# Altium schematic sheet [1]H-bridge1&Current_sensor&NOT_gate.SchDoc
size A3
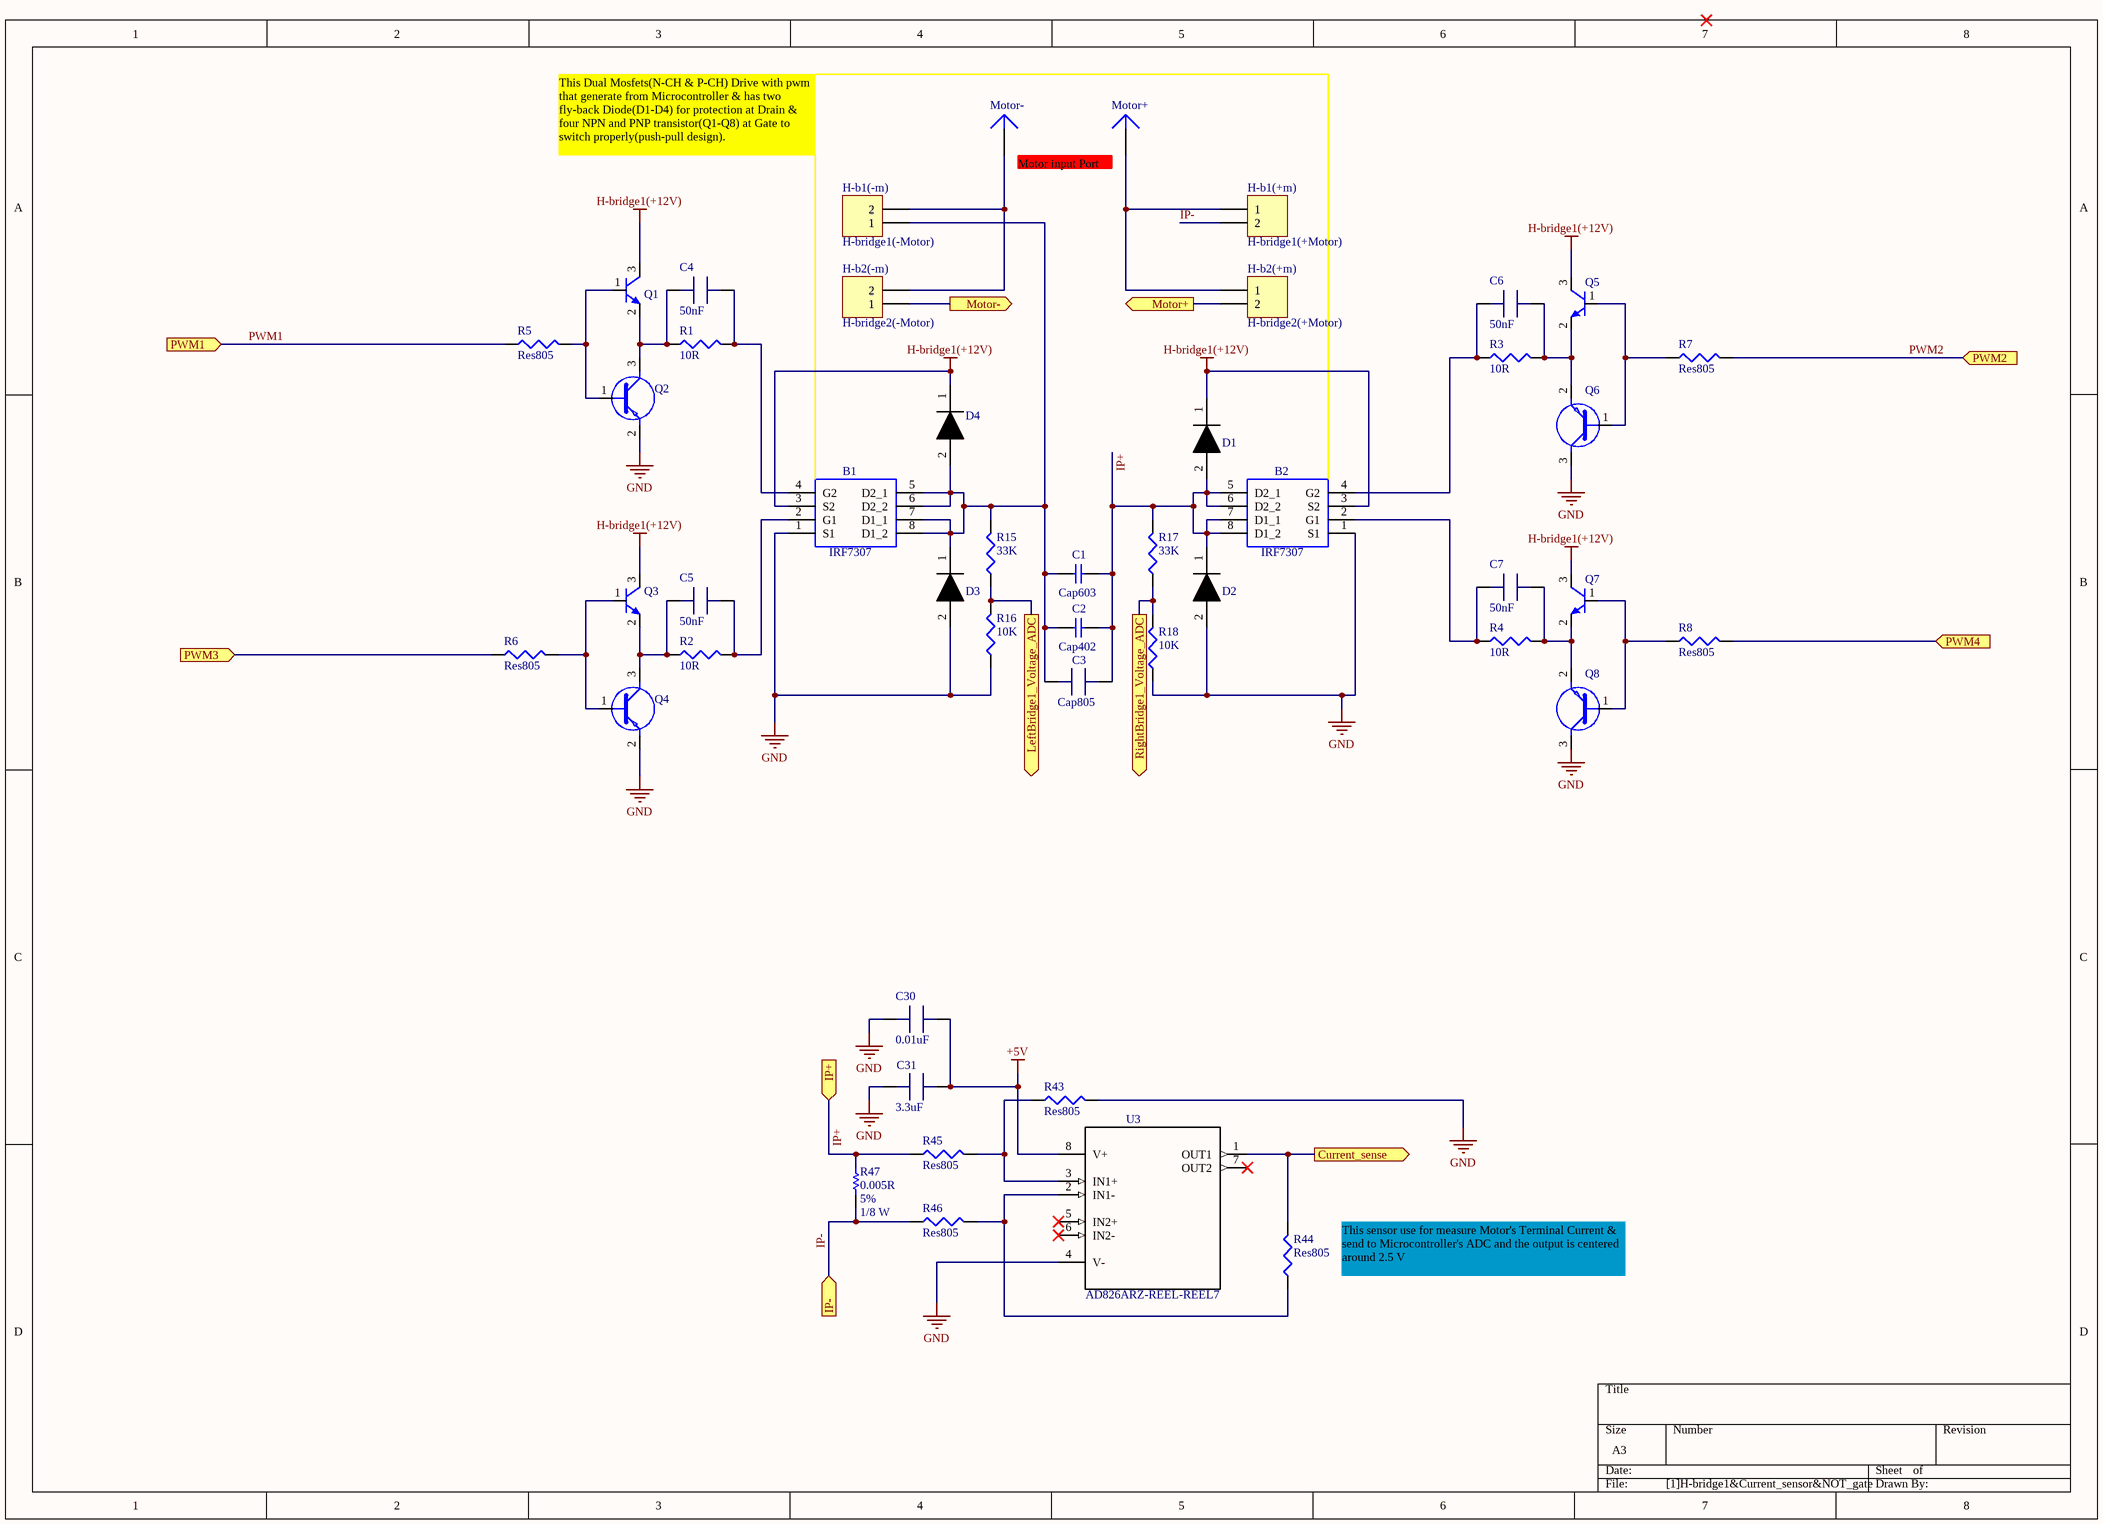
[diagram p0: [1]H-bridge1&Current_sensor&NOT_gate.SchDoc]

## Parts
B1  IRF7307  [SOIC127P600X175-8N]
B2  IRF7307  [SOIC127P600X175-8N]
C1  Cap603  [Cap603]
C2  Cap402  [Cap402]
C3  Cap805  [cap_805]
C4  50nF  [cap_805]
C5  50nF  [cap_805]
C6  50nF  [cap_805]
C7  50nF  [cap_805]
C30  0.01uF  [cap_805]
C31  3.3uF  [cap_805]
D1  Doide_SS34  [Doide_SS34]  (value not drawn)
D2  Doide_SS34  [Doide_SS34]  (value not drawn)
D3  Doide_SS34  [Doide_SS34]  (value not drawn)
D4  Doide_SS34  [Doide_SS34]  (value not drawn)
H-b1(+m)  H-bridge1(+Motor)  [HDR1X2]
H-b1(-m)  H-bridge1(-Motor)  [HDR1X2]
H-b2(+m)  H-bridge2(+Motor)  [HDR1X2]
H-b2(-m)  H-bridge2(-Motor)  [HDR1X2]
Motor+  Plug  [PIN1]  (value not drawn)
Motor-  Plug  [PIN1]  (value not drawn)
Q1  NPN(mmbt2222)  [MMBT2222]  (value not drawn)
Q2  MMBT2907A-7-F  [SOT96P240X100-3N]  (value not drawn)
Q3  NPN(mmbt2222)  [MMBT2222]  (value not drawn)
Q4  MMBT2907A-7-F  [SOT96P240X100-3N]  (value not drawn)
Q5  NPN(MMBT2222)  [MMBT2222]  (value not drawn)
Q6  MMBT2907A-7-F  [SOT96P240X100-3N]  (value not drawn)
Q7  NPN(mmbt2222)  [MMBT2222]  (value not drawn)
Q8  MMBT2907A-7-F  [SOT96P240X100-3N]  (value not drawn)
R1  10R  [Res805]
R2  10R  [Res805]
R3  10R  [Res805]
R4  10R  [Res805]
R5  Res805  [Res805]
R6  Res805  [Res805]
R7  Res805  [Res805]
R8  Res805  [Res805]
R15  33K  [Res805]
R16  10K  [Res805]
R17  33K  [Res805]
R18  10K  [Res805]
R43  Res805  [Res805]
R44  Res805  [Res805]
R45  Res805  [Res805]
R46  Res805  [Res805]
R47  Tolerance: 5%  Power: 1/8 W  [RES 2512 (6331X07L)]  (hidden comment: 0.005R)
U3  AD826ARZ-REEL-REEL7  [*SOIC127P600X175-8N]

## Ports
Current_sense (out), IP+ (in), IP- (in), LeftBridge1_Voltage_ADC (out), Motor+ (out), Motor- (out), PWM1 (in), PWM2 (in), PWM3 (in), PWM4 (in), RightBridge1_Voltage_ADC (out)

## Nets
+5V: C30.2 C31.2 U3.8(V+)
GND: B1.1(S1) B2.1(S1) C30.1 C31.1 D2.2 D3.2 Q2.2(E) Q4.2(E) Q6.3(C) Q8.3(C) R16.1 R18.1 R43.2 U3.4(V-)
H-bridge1(+12V): B1.3(S2) B2.3(S2) D1.1 D4.1 Q1.3(C) Q3.3(C) Q5.3(C) Q7.3(C)
Current_sense: R44.2 U3.1(OUT1) ; port Current_sense
IP+: B2.5(D2_1) B2.6(D2_2) B2.7(D1_1) B2.8(D1_2) C1.2 C2.2 C3.2 D1.2 D2.1 R17.2 R45.1 R47.2 ; port IP+
IP-: H-b1(+m).2 R46.1 R47.1 ; port IP-
LeftBridge1_Voltage_ADC: R15.1 R16.2 ; port LeftBridge1_Voltage_ADC
Motor+: H-b2(+m).2 ; port Motor+
Motor-: H-b2(-m).1 ; port Motor-
PWM1: R5.1 ; port PWM1
PWM2: R7.2 ; port PWM2
PWM3: R6.1 ; port PWM3
PWM4: R8.2 ; port PWM4
RightBridge1_Voltage_ADC: R17.1 R18.2 ; port RightBridge1_Voltage_ADC
NetB1_2: B1.2(G1) C5.2 R2.2
NetB1_4: B1.4(G2) C4.2 R1.2
NetB1_5: B1.5(D2_1) B1.6(D2_2) B1.7(D1_1) B1.8(D1_2) C1.1 C2.1 C3.1 D3.1 D4.2 H-b1(-m).1 R15.2
NetB2_2: B2.2(G1) C7.1 R4.1
NetB2_4: B2.4(G2) C6.1 R3.1
NetC4_1: C4.1 Q1.2(E) Q2.3(C) R1.1
NetC5_1: C5.1 Q3.2(E) Q4.3(C) R2.1
NetC6_2: C6.2 Q5.2(E) Q6.2(E) R3.2
NetC7_2: C7.2 Q7.2(E) Q8.2(E) R4.2
NetH-b1(+m)_1: H-b1(+m).1 H-b2(+m).1 Motor+.1
NetH-b1(-m)_2: H-b1(-m).2 H-b2(-m).2 Motor-.1
NetQ1_1: Q1.1(B) Q2.1(B) R5.2
NetQ3_1: Q3.1(B) Q4.1(B) R6.2
NetQ5_1: Q5.1(B) Q6.1(B) R7.1
NetQ7_1: Q7.1(B) Q8.1(B) R8.1
NetR43_1: R43.1 R45.2 U3.3(IN1+)
NetR44_1: R44.1 R46.2 U3.2(IN1-)

Not connected (* = marked no-connect by the designer): U3 5(IN2+)* 6(IN2-)* 7(OUT2)*

## Notes on the sheet
- This Dual Mosfets(N-CH & P-CH) Drive with pwm that generate from Microcontroller & has two fly-back Diode(D1-D4) for protection at Drain & four NPN and PNP transistor(Q1-Q8) at Gate to switch properly(push-pull design).
- Motor input Port
- This sensor use for measure Motor's Terminal Current & send to Microcontroller's ADC and the output is centered around 2.5 V

## Library data of the parts
B1 B2 = IRF7307: Power MOSFET; Manufacturer_Name: International Rectifier; Geometry.Height: 1.75mm; Manufacturer_Part_Number: IRF7307; RS Part Number: 2171031; RS Price/Stock: http://uk.rs-online.com/web/p/products/2171031; Arrow Part Number: IRF7307; Arrow Price/Stock: http://uk.rs-online.com/web/p/products/2171031; Datasheet Link: www.farnell.com/datasheets/137583.pdf
C4-C7 C30 C31 = cap805
H-b1(+m) H-b1(-m) H-b2(+m) H-b2(-m) = Header 2: Header, 2-Pin; LatestRevisionDate: 17-Jul-2002; LatestRevisionNote: Re-released for DXP Platform.; Publisher: Altium Limited
Q1 Q3 Q5 Q7 = MMBT2222
Q2 Q4 Q6 Q8 = MMBT2907A-7-F: Diodes Inc MMBT2907A-7-F PNP Bipolar Transistor, -600 mA, -60 V, 3-Pin SOT-23; Manufacturer_Name: Diodes Inc.; Geometry.Height: 1mm; Manufacturer_Part_Number: MMBT2907A-7-F; RS Part Number: 7114875P; RS Price/Stock: http://uk.rs-online.com/web/p/products/7114875P; Arrow Part Number: MMBT2907A-7-F; Arrow Price/Stock: https://www.arrow.com/en/products/mmbt2907a-7-f/diodes-incorporated; Datasheet Link: https://www.diodes.com/assets/Datasheets/ds30040.pdf
R1-R4 R15-R18 = Res805
R47 = RES: Resistor; Designer: Saeid Jorablo; Category: Resistors; PackageDescription: SMD & TH Resistors; Publisher: Altium Limited; Mounting Technology: Surface Mount\Through-Hole; Value: 0.005R; HelpURL: http://s3.picofile.com/file/7443264187/Coming_Soon_logo.gif
U3 = AD826ARZ-REEL-REEL7: OP Amp Dual Volt Fdbk Ã‚Â±18V/36V 8-Pin SO T/R; MP: AD826ARZ-REEL7; MF: Analog Devices; Package: SOIC-8 Analog Devices; Price: None; SnapEDA_Link: https://www.snapeda.com/parts/AD826ARZ-REEL7/Analog%20Devices%20Inc./view-part/?ref=snap; Availability: Unavailable; Value: *
Motor+ Motor- = Plug: LatestRevisionDate: 17-Jul-2002; LatestRevisionNote: Re-released for DXP Platform.; Publisher: Altium Limited